# EAGLE schematic DAU_Kupplung.brd_V1_1 (EAGLE 5.11)
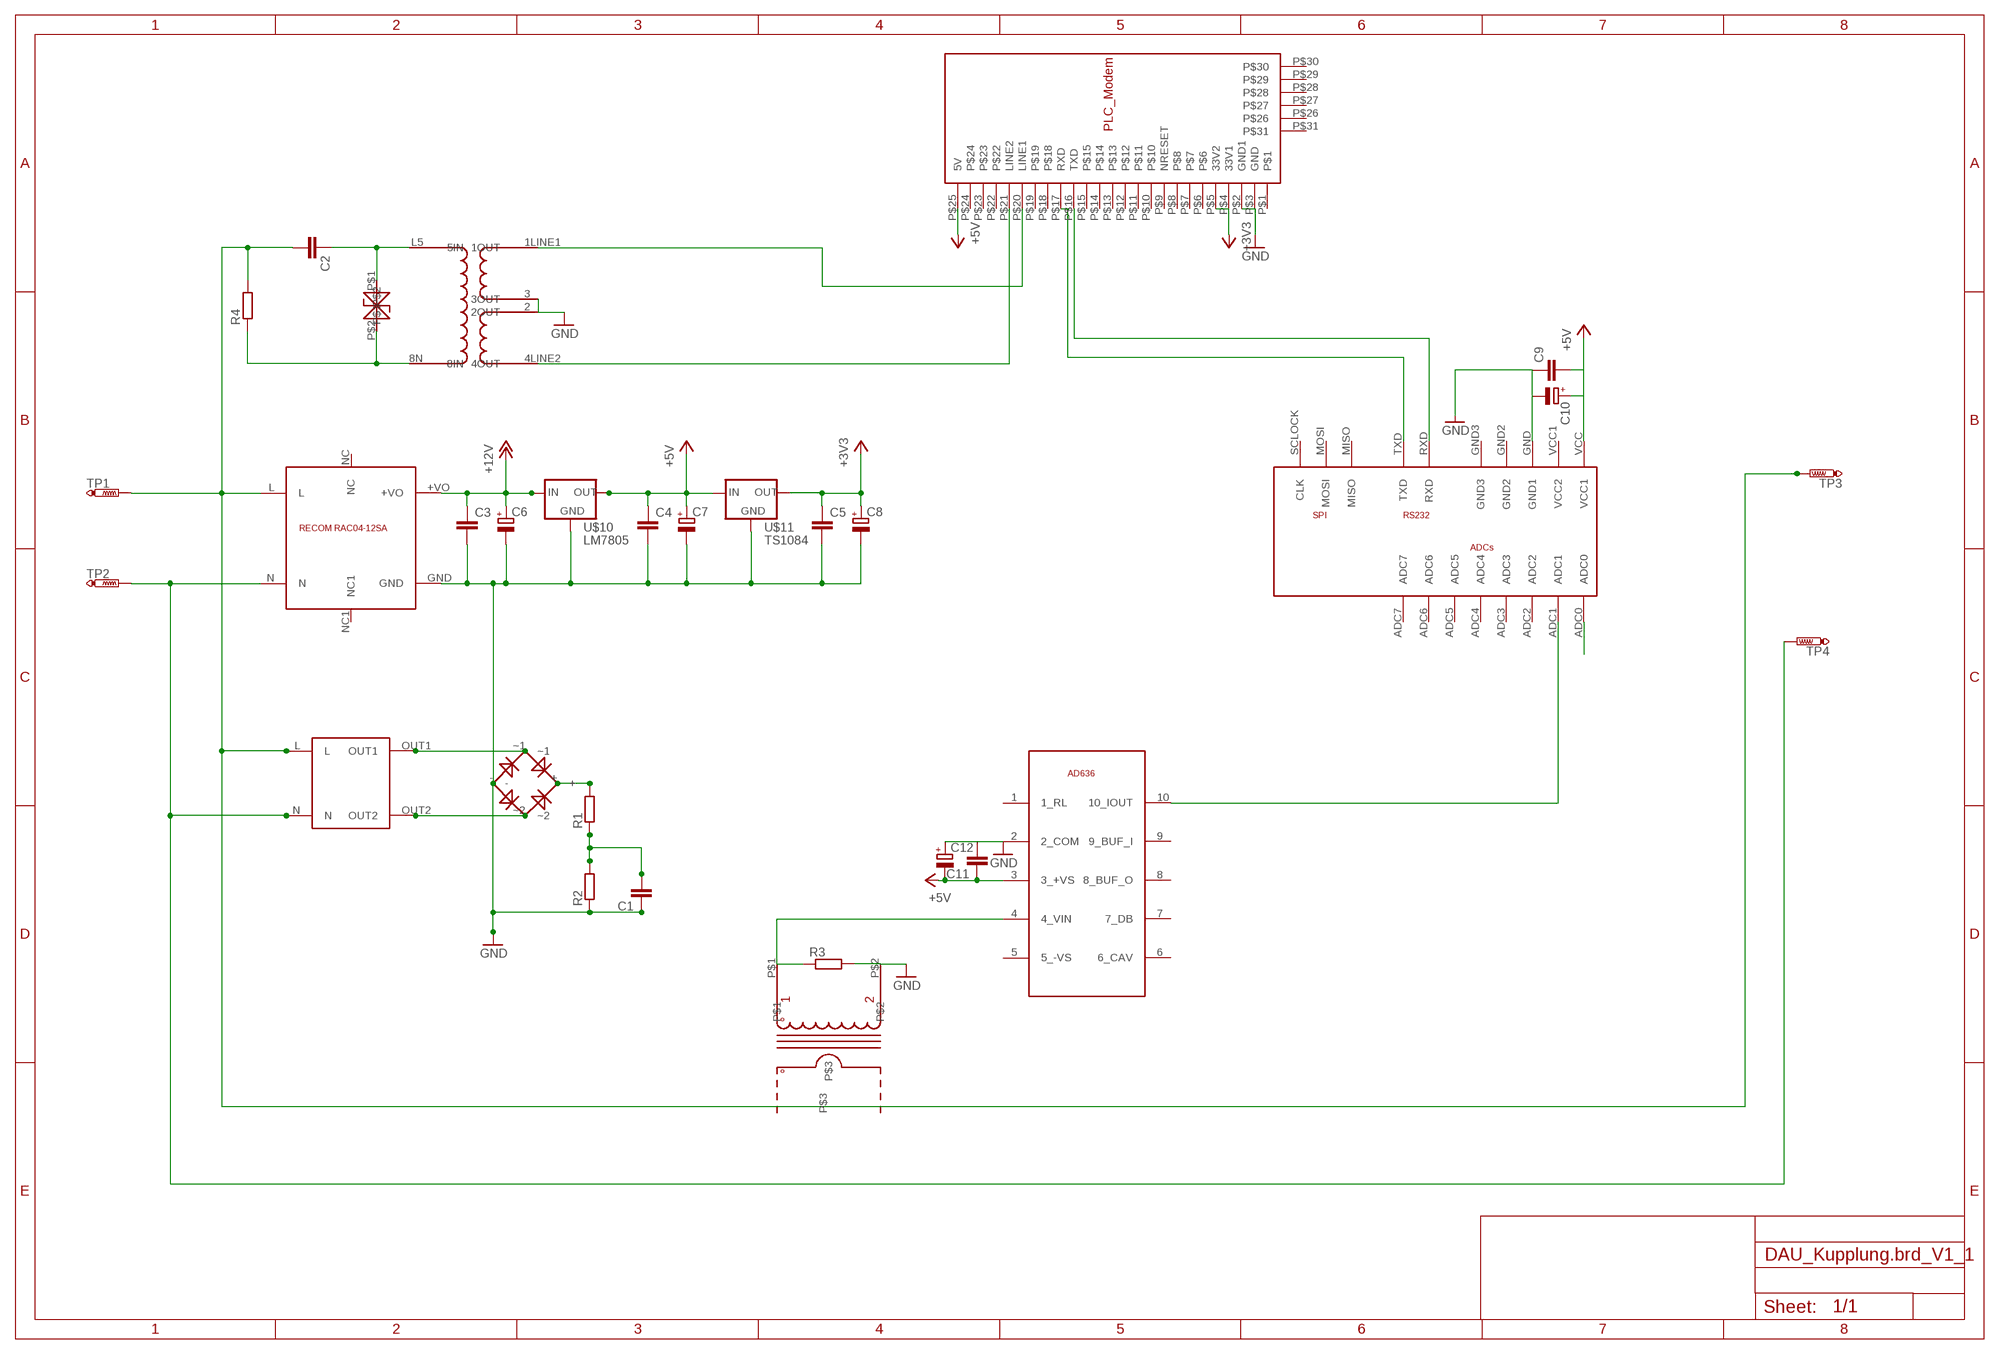
[diagram p0: schematic, sheet 1]

## Parts
C1  C2,5-3  [C2.5-3]
C2  C-EU225-087X268  [C225-087X268]
C3  C-EU025-040X050  [C025-040X050]
C4  C-EU025-040X050  [C025-040X050]
C5  C-EU025-040X050  [C025-040X050]
C6  CPOL-EUE2.5-6  [E2,5-6]
C7  CPOL-EUE2.5-6  [E2,5-6]
C8  CPOL-EUE2.5-6  [E2,5-6]
C9  C-EU025-040X050  [C025-040X050]
C10  CPOL-EUE2,5-6E  [E2,5-6E]
C11  C-EU025-040X050  [C025-040X050]
C12  CPOL-EUE2,5-6E  [E2,5-6E]
R1  R-EU_0204/7  [0204/7]
R2  R-EU_0204/7  [0204/7]
R3  R-EU_0204/7  [0204/7]
R4  R-EU_0204/7  [0204/7]
TP1  PTR1PAD1-17Y  [P1-17Y]
TP2  PTR1PAD1-17Y  [P1-17Y]
TP3  PTR1PAD1-17Y  [P1-17Y]
TP4  PTR1PAD1-17Y  [P1-17Y]
U$1  RECOM_RAC04_12SA  [RAC04_12SA]
U$2  SICHERHEITSTRAFO  [TRAFO_0,35VA]
U$3  ADUC831_MINIMUM  [ADUC_MINIMUM]
U$4  MODEMSTECKER  [MODEM_FUSS]
U$5  PLC_UEBERTRAGER_V2  [PLC-UEBERTRAGER_V2]
U$6  AC1010  [AC1010]
U$7  AD636  [TO100_10PIN]
U$8  RECTIFIER  [RECTIFIER]
U$9  SUPPRESSORDIODE15MM  [DIODE15_5MM]
U$10  LM7805  [LM7805]
U$11  TS1084  [TS1084]

## Nets
+3V3: C5.1 C8.+ U$4.P$4(33V1) U$4.P$5(33V2) U$11.2OUT(OUT)
+5V: C4.1 C7.+ C9.2 C10.+ C11.1 C12.- U$3.VCC(VCC1) U$4.P$25(5V) U$7.3(3_+VS) U$10.OUT U$11.3IN(IN)
+12V: C3.1 C6.+ U$1.+VO U$10.IN
GND: C1.1 C3.2 C4.2 C5.2 C6.- C7.- C8.- C12.+ R2.1 R3.2 U$1.GND U$4.P$2(GND1) U$4.P$3(GND) U$5.2(2OUT) U$5.3(3OUT) U$6.P$2 U$7.2(2_COM) U$8.- U$10.GND U$11.1GND(GND)
N$1: C9.1 U$3.GND(GND1)
N$2: R4.1 U$5.8N(8IN) U$9.P$2
N$3: U$2.OUT1 U$8.~1
N$4: U$2.OUT2 U$8.~2
N$5: U$4.P$20(LINE1) U$5.1LINE1(1OUT)
N$6: C1.2 R1.1 R2.2 U$3.ADC0
N$7: R1.2 U$8.+
N$8: R3.1 U$6.P$1 U$7.4(4_VIN)
N$9: U$3.ADC1 U$7.10(10_IOUT)
N$10: TP2.TP TP4.TP U$1.N U$2.N
N$11: C2.1 U$5.L5(5IN) U$9.P$1
N$12: C2.2 R4.2 TP1.TP TP3.TP U$1.L U$2.L
N$13: U$4.P$21(LINE2) U$5.4LINE2(4OUT)
N$14: U$3.RXD U$4.P$16(TXD)
N$15: U$3.TXD U$4.P$17(RXD)
Unconnected: C10.- C11.2 U$1.NC U$1.NC1 U$3.ADC2 U$3.ADC3 U$3.ADC4 U$3.ADC5 U$3.ADC6 U$3.ADC7 U$3.GND2 U$3.GND3 U$3.MISO U$3.MOSI U$3.SCLOCK(CLK) U$3.VCC1(VCC2) U$4.P$1 U$4.P$6 U$4.P$7 U$4.P$8 U$4.P$9(NRESET) U$4.P$10 U$4.P$11 U$4.P$12 U$4.P$13 U$4.P$14 U$4.P$15 U$4.P$18 U$4.P$19 U$4.P$22 U$4.P$23 U$4.P$24 U$4.P$26 U$4.P$27 U$4.P$28 U$4.P$29 U$4.P$30 U$4.P$31 U$6.P$3 U$7.1(1_RL) U$7.5(5_-VS) U$7.6(6_CAV) U$7.7(7_DB) U$7.8(8_BUF_O) U$7.9(9_BUF_I)

## Library data of the parts
C1 = capacitor-wima:C: CAPACITOR naming: grid - package width
C2-C5 = resistor:C-EU: CAPACITOR, European symbol
C6-C8 = resistor:CPOL-EU: POLARIZED CAPACITOR, European symbol
C9 C11 = rcl:C-EU: CAPACITOR, European symbol
C10 C12 = rcl:CPOL-EU: POLARIZED CAPACITOR, European symbol
R1-R4 = resistor:R-EU_: RESISTOR, European symbol
TP1-TP4 = testpad:PTR1: TEST PIN
U$1 = ADS:RECOM_RAC04_12SA
U$2 = ADS:SICHERHEITSTRAFO
U$3 = ADS_ADUCBoards:ADUC831_MINIMUM
U$4 = ADS:MODEMSTECKER
U$5 = ADS1:PLC_UEBERTRAGER_V2
U$6 = ADS:AC1010
U$7 = ADS:AD636
U$8 = ADS:RECTIFIER
U$9 = ADS:SUPPRESSORDIODE15MM
U$10 = ADS:LM7805
U$11 = ADS1:TS1084